# EAGLE schematic v1 (EAGLE 9.4.2)
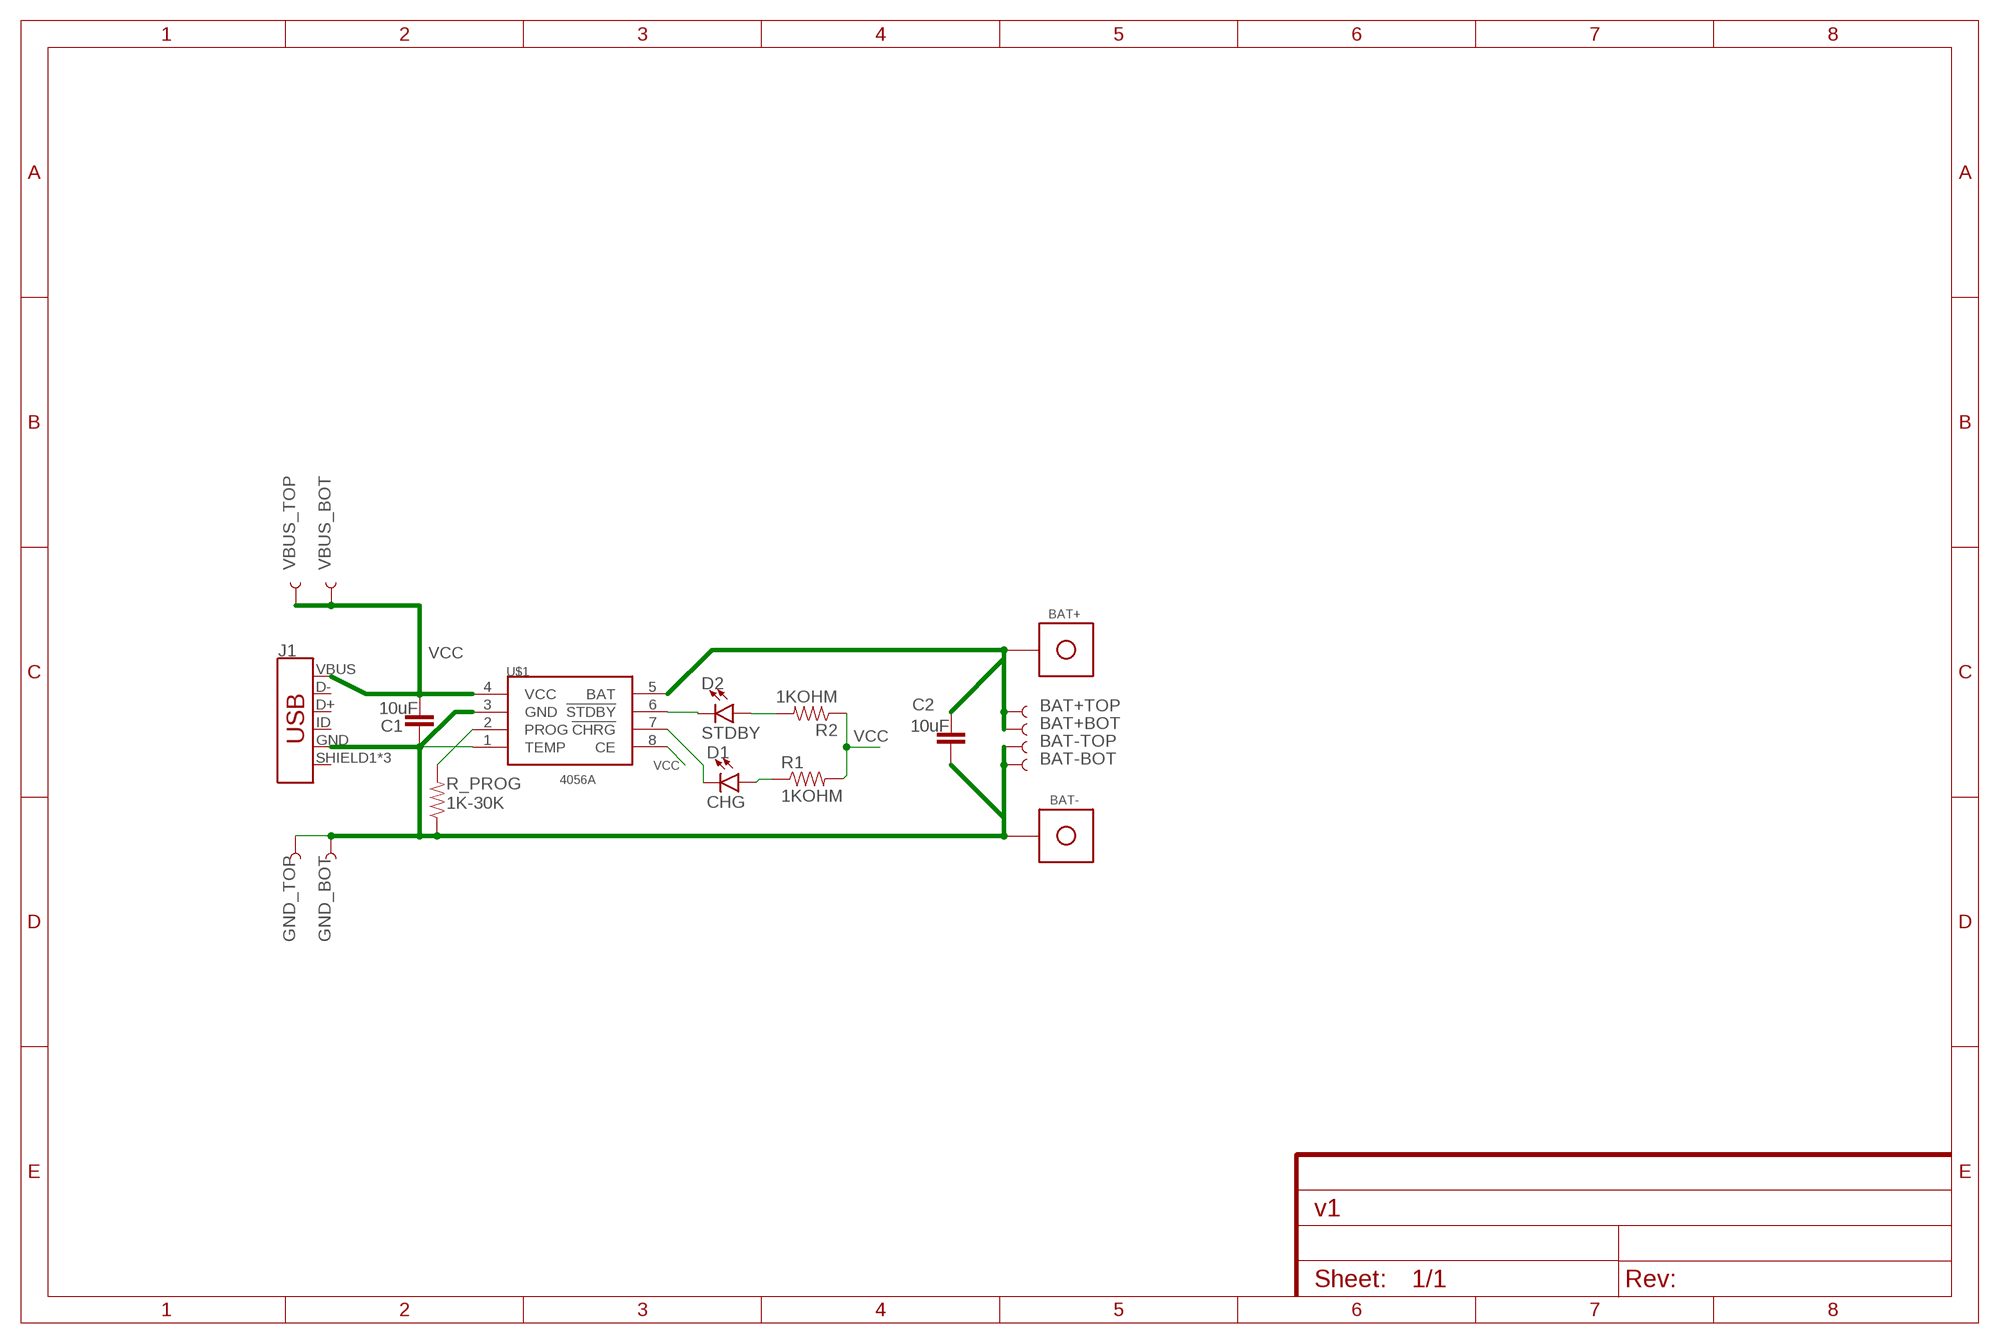
[diagram p0: schematic, sheet 1]

## Parts
BAT+  BAT_TAB  [BATT_TAB]
BAT+BOT  TEST-POINT3  [PAD.03X.03]
BAT+TOP  TEST-POINT3  [PAD.03X.03]
BAT-  BAT_TAB  [BATT_TAB]
BAT-BOT  TEST-POINT3  [PAD.03X.03]
BAT-TOP  TEST-POINT3  [PAD.03X.03]
C1  10uF  0.1UF-0402-16V-10%  [0402]
C2  10uF  0.1UF-0402-16V-10%  [0402]
D1  CHG  LED0603  [LED-0603]
D2  STDBY  LED0603  [LED-0603]
GND_BOT  TEST-POINT3  [PAD.03X.03]
GND_TOP  TEST-POINT3  [PAD.03X.03]
J1  USB_MICRO-B_FEMALE-SMT  [USB-B-MICRO-SMD]
R1  1KOHM  2.2KOHM-0402-1/16W-1%  [0402]
R2  1KOHM  2.2KOHM-0402-1/16W-1%  [0402]
R_PROG  1K-30K  2.2KOHM-0402-1/16W-1%  [0402]
U$1  4056A  [SOP-8]
VBUS_BOT  TEST-POINT3  [PAD.03X.03]
VBUS_TOP  TEST-POINT3  [PAD.03X.03]

## Nets
N$1: R_PROG.2 U$1.2(PROG)
N$2: BAT-.P$1 BAT-BOT.P$1 BAT-TOP.P$1 C1.2 C2.2 GND_BOT.P$1 GND_TOP.P$1 J1.GND R_PROG.1 U$1.1(TEMP) U$1.3(GND)
N$3: D2.C U$1.6(!STDBY)
N$4: D1.C U$1.7(!CHRG)
N$5: D2.A R2.2
N$6: D1.A R1.1
N$7: BAT+.P$1 BAT+BOT.P$1 BAT+TOP.P$1 C2.1 U$1.5(BAT)
VCC: C1.1 J1.VBUS R1.2 R2.1 U$1.4(VCC) U$1.8(CE) VBUS_BOT.P$1 VBUS_TOP.P$1
Unconnected: J1.D+ J1.D- J1.ID J1.SHIELD1(SHIELD) J1.SHIELD2(SHIELD) J1.SHIELD3(SHIELD)

## Library data of the parts
BAT+ BAT- = ugurkrcl:BAT_TAB
BAT+BOT BAT+TOP BAT-BOT BAT-TOP GND_BOT GND_TOP VBUS_BOT VBUS_TOP = SparkFun-Connectors:TEST-POINT: SparkFun Test Points Bare copper test points for troubleshooting or In-Circuit-Testing. These are used by our Production team for verifying production board runs using pogo-pins on test beds. SparkFun Products: SparkFun LSM9DS1 Breakout <https://www.sparkfun.com/products/13284> SparkFun PSOC <https://www.sparkfun.com/products/13714> SparkFun Load Cell Amplifier <https://www.sparkfun.com/products/13879>
C1 C2 = SparkFun-Capacitors:0.1UF: 0.1µF ceramic capacitors A capacitor is a passive two-terminal electrical component used to store electrical energy temporarily in an electric field.; PROD_ID: CAP-12416; VALUE: 0.1uF
D1 D2 = SparkFun-LED:LED: LED (Generic) Standard schematic elements and footprints for 5mm, 3mm, 1206, and 0603 sized LEDs. Generic LEDs with no color specified.
J1 = SparkFun-Connectors:USB_MICRO-B: USB Type Micro-B Connector Male/female and PTH/SMT variants SparkFun Products: SparkFun microB USB Breakout <https://www.sparkfun.com/products/12035> SparkFun USB microB Plug Breakout <https://www.sparkfun.com/products/10031> SparkFun ESP8266 Thing <https://www.sparkfun.com/products/13231>; PROD_ID: CONN-11752
R1 R2 R_PROG = SparkFun-Resistors:2.2KOHM: 2.2kΩ resistor A resistor is a passive two-terminal electrical component that implements electrical resistance as a circuit element. Resistors act to reduce current flow, and, at the same time, act to lower voltage levels within circuits. - Wikipedia; PROD_ID: RES-14341
U$1 = ugurkrcl:4056A